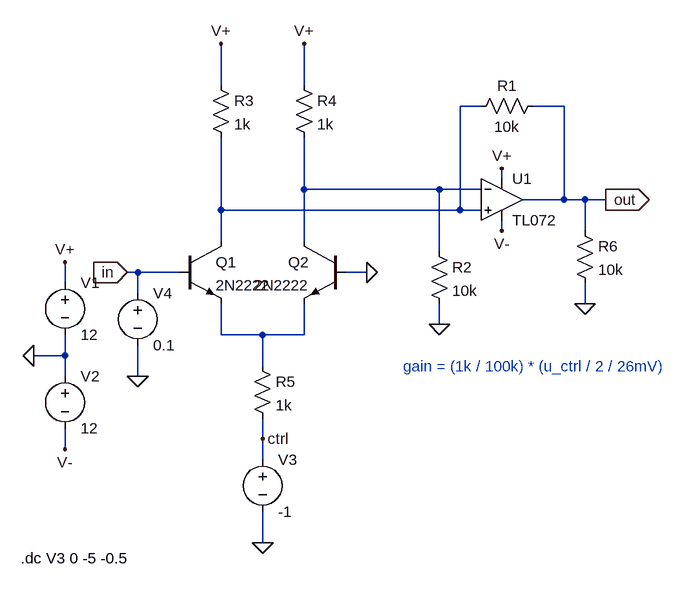
[diagram p0: schematic 2023-04-09 analog multiplier slope.asc]
2023-04-09 analog multiplier slope.asc, the LTspice schematic file:
Version 4
SHEET 1 880 680
WIRE -16 -128 -16 -192
WIRE 112 -128 112 -192
WIRE 384 -96 352 -96
WIRE 512 -96 464 -96
WIRE 416 16 416 0
WIRE 112 32 112 -48
WIRE 320 32 112 32
WIRE 384 32 320 32
WIRE 512 48 512 -96
WIRE 512 48 448 48
WIRE 544 48 512 48
WIRE 576 48 544 48
WIRE -16 64 -16 -48
WIRE 352 64 352 -96
WIRE 352 64 -16 64
WIRE 384 64 352 64
WIRE 416 96 416 80
WIRE 544 96 544 48
WIRE -16 112 -16 64
WIRE 112 112 112 32
WIRE 320 128 320 32
WIRE -144 160 -160 160
WIRE -80 160 -144 160
WIRE 208 160 176 160
WIRE -256 176 -256 144
WIRE -144 192 -144 160
WIRE 544 208 544 176
WIRE 320 240 320 208
WIRE -16 256 -16 208
WIRE 48 256 -16 256
WIRE 112 256 112 208
WIRE 112 256 48 256
WIRE -256 288 -256 256
WIRE -256 288 -304 288
WIRE 48 304 48 256
WIRE -256 320 -256 288
WIRE -144 320 -144 272
WIRE 48 416 48 384
WIRE -256 432 -256 400
WIRE 48 448 48 416
WIRE 48 576 48 528
FLAG -304 288 0
FLAG -256 144 V+
FLAG -256 432 V-
FLAG 416 0 V+
FLAG 416 96 V-
FLAG 320 240 0
FLAG 48 576 0
FLAG -144 320 0
FLAG -16 -192 V+
FLAG 112 -192 V+
FLAG 208 160 0
FLAG 576 48 out
IOPIN 576 48 Out
FLAG 544 208 0
FLAG -160 160 in
IOPIN -160 160 In
FLAG 48 416 ctrl
SYMBOL voltage -256 160 R0
WINDOW 123 0 0 Left 0
WINDOW 39 0 0 Left 0
SYMATTR InstName V1
SYMATTR Value 12
SYMBOL voltage -256 304 R0
WINDOW 123 0 0 Left 0
WINDOW 39 0 0 Left 0
SYMATTR InstName V2
SYMATTR Value 12
SYMBOL custom\\TL072 416 48 R0
SYMATTR InstName U1
SYMBOL res 480 -112 R90
WINDOW 0 0 56 VBottom 2
WINDOW 3 32 56 VTop 2
SYMATTR InstName R1
SYMATTR Value 10k
SYMBOL res 304 112 R0
SYMATTR InstName R2
SYMATTR Value 10k
SYMBOL res -32 -144 R0
SYMATTR InstName R3
SYMATTR Value 1k
SYMBOL res 96 -144 R0
SYMATTR InstName R4
SYMATTR Value 1k
SYMBOL npn -80 112 R0
SYMATTR InstName Q1
SYMATTR Value 2N2222
SYMBOL npn 176 112 M0
SYMATTR InstName Q2
SYMATTR Value 2N2222
SYMBOL res 32 288 R0
SYMATTR InstName R5
SYMATTR Value 1k
SYMBOL voltage 48 432 R0
WINDOW 123 0 0 Left 0
WINDOW 39 0 0 Left 0
SYMATTR InstName V3
SYMATTR Value -1
SYMBOL voltage -144 176 R0
WINDOW 123 0 0 Left 0
WINDOW 39 0 0 Left 0
SYMATTR InstName V4
SYMATTR Value 0.1
SYMBOL res 528 80 R0
SYMATTR InstName R6
SYMATTR Value 10k
TEXT 264 304 Left 2 ;gain = (1k / 100k) * (u_ctrl / 2 / 26mV)
TEXT -324 600 Left 2 !.dc V3 0 -5 -0.5

The netlist it stands for:
* 2023-04-09 analog multiplier slope.asc
V1 V+ 0 12
V2 0 V- 12
* U1: TL072 (symbol custom\TL072 not available, pins judged from their places): In+=N001 In-=N002 V+=V+ V-=V- OUT=out
R1 out N001 10k
R2 N002 0 10k
R3 V+ N001 1k
R4 V+ N002 1k
Q1 N001 in N003 0 2N2222
Q2 N002 0 N003 0 2N2222
R5 N003 ctrl 1k
V3 ctrl 0 -1
V4 in 0 0.1
R6 out 0 10k
.model NPN NPN
.model PNP PNP
.lib standard.bjt
* gain = (1k / 100k) * (u_ctrl / 2 / 26mV)
.dc V3 0 -5 -0.5
.backanno
.end